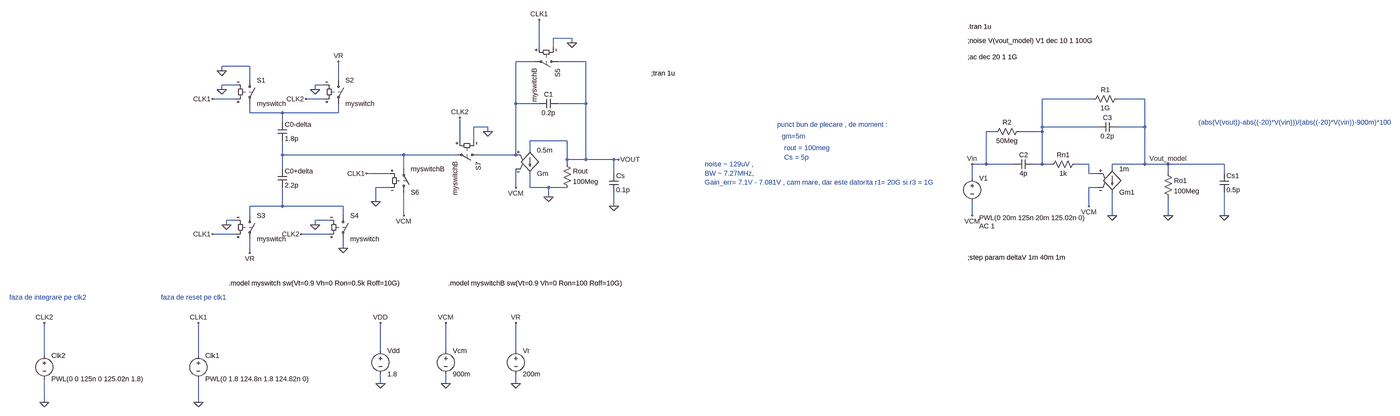
[diagram p0: schematic SCmodel_sw.asc, whole sheet]
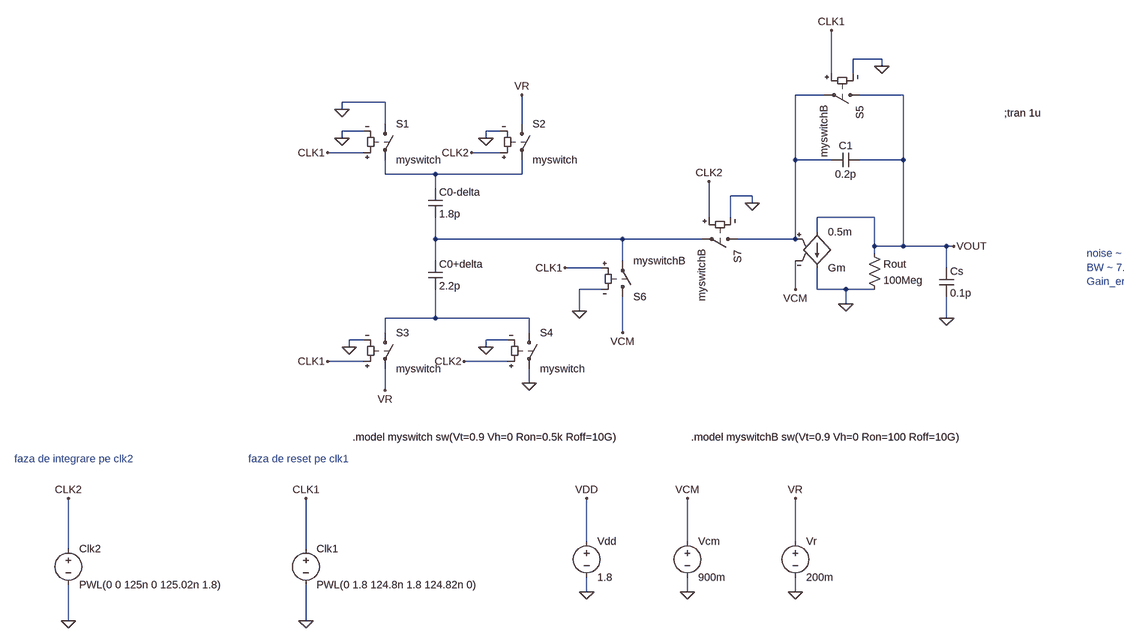
[diagram p1: schematic SCmodel_sw.asc, part, row 1 of 1, column 1 of 2]
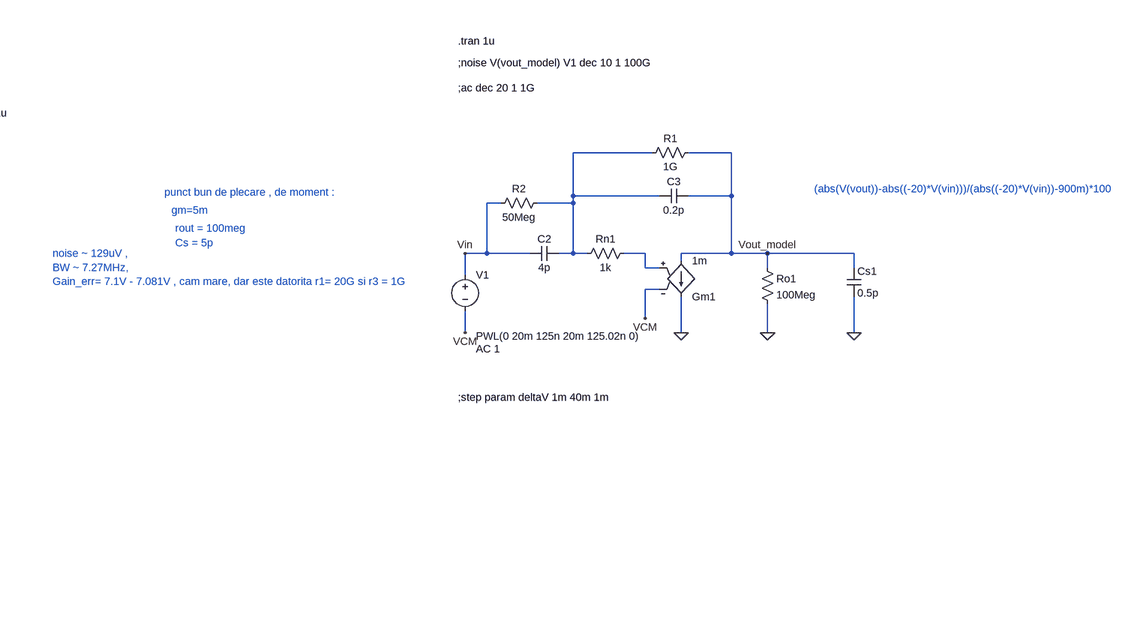
[diagram p2: schematic SCmodel_sw.asc, part, row 1 of 1, column 2 of 2]
SCmodel_sw.asc, the LTspice schematic file:
Version 4
SHEET 1 4916 1124
WIRE 1024 -208 960 -208
WIRE 1024 -192 1024 -208
WIRE 912 -176 912 -272
WIRE 960 -176 960 -208
WIRE 896 -128 832 -128
WIRE 1072 -128 976 -128
WIRE -80 -112 -176 -112
WIRE -176 -96 -176 -112
WIRE -80 -64 -80 -112
WIRE 224 -64 224 -128
WIRE -128 -48 -176 -48
WIRE 176 -48 144 -48
WIRE -176 -32 -176 -48
WIRE 144 -32 144 -48
WIRE -128 0 -208 0
WIRE 176 0 112 0
WIRE 3792 0 3616 0
WIRE 3968 0 3872 0
WIRE 832 16 832 -128
WIRE 912 16 832 16
WIRE 1072 16 1072 -128
WIRE 1072 16 976 16
WIRE -80 48 -80 16
WIRE 32 48 -80 48
WIRE 224 48 224 16
WIRE 224 48 32 48
WIRE 32 80 32 48
WIRE 736 96 688 96
WIRE 3616 96 3616 0
WIRE 3808 96 3616 96
WIRE 3968 96 3968 0
WIRE 3968 96 3872 96
WIRE 736 112 736 96
WIRE 3456 112 3424 112
WIRE 3616 112 3616 96
WIRE 3616 112 3536 112
WIRE 640 144 640 64
WIRE 688 144 688 96
WIRE 1008 144 880 144
WIRE 880 176 880 144
WIRE 32 192 32 144
WIRE 448 192 32 192
WIRE 624 192 448 192
WIRE 832 192 832 16
WIRE 832 192 704 192
WIRE 1008 208 1008 144
WIRE 1072 208 1072 16
WIRE 1072 208 1008 208
WIRE 1168 208 1072 208
WIRE 1184 208 1168 208
WIRE 1008 224 1008 208
WIRE 3424 224 3424 112
WIRE 3424 224 3376 224
WIRE 3520 224 3424 224
WIRE 3616 224 3616 112
WIRE 3616 224 3584 224
WIRE 3648 224 3616 224
WIRE 3776 224 3728 224
WIRE 3968 224 3968 96
WIRE 3968 224 3856 224
WIRE 4048 224 3968 224
WIRE 4240 224 4048 224
WIRE 32 240 32 192
WIRE 448 240 448 192
WIRE 3856 240 3856 224
WIRE 400 256 320 256
WIRE 1168 256 1168 208
WIRE 3776 256 3776 224
WIRE 3808 256 3776 256
WIRE 4048 256 4048 224
WIRE 4240 256 4240 224
WIRE 3376 272 3376 224
WIRE 400 304 352 304
WIRE 832 304 832 240
WIRE 880 304 880 256
WIRE 944 304 880 304
WIRE 1008 304 944 304
WIRE 3808 304 3776 304
WIRE 944 336 944 304
WIRE 352 352 352 304
WIRE 32 368 32 304
WIRE 32 368 -80 368
WIRE 240 368 32 368
WIRE 1168 368 1168 320
WIRE 3776 368 3776 304
WIRE -80 400 -80 368
WIRE 240 400 240 368
WIRE 448 400 448 320
WIRE 3376 400 3376 352
WIRE 3856 400 3856 320
WIRE 4048 400 4048 336
WIRE 4240 400 4240 320
WIRE -128 416 -160 416
WIRE 192 416 144 416
WIRE -160 432 -160 416
WIRE 144 432 144 416
WIRE -128 464 -208 464
WIRE 192 464 96 464
WIRE 240 512 240 480
WIRE -80 528 -80 480
WIRE 368 864 368 768
WIRE 592 864 592 768
WIRE 832 864 832 768
WIRE -784 880 -784 768
WIRE -256 880 -256 768
WIRE 368 976 368 944
WIRE 592 976 592 944
WIRE 832 976 832 944
WIRE -784 1040 -784 960
WIRE -256 1040 -256 960
FLAG 96 464 CLK2
FLAG 112 0 CLK2
FLAG -208 0 CLK1
FLAG -208 464 CLK1
FLAG -160 432 0
FLAG 144 432 0
FLAG 144 -32 0
FLAG -176 -32 0
FLAG -176 -96 0
FLAG 240 512 0
FLAG -80 528 VR
FLAG 224 -128 VR
FLAG -256 768 CLK1
FLAG -784 768 CLK2
FLAG -256 1040 0
FLAG -784 1040 0
FLAG 368 976 0
FLAG 592 976 0
FLAG 832 976 0
FLAG 832 768 VR
FLAG 592 768 VCM
FLAG 368 768 VDD
FLAG 1184 208 VOUT
FLAG 912 -272 CLK1
FLAG 1024 -192 0
FLAG 640 64 CLK2
FLAG 352 352 0
FLAG 320 256 CLK1
FLAG 448 400 VCM
FLAG 736 112 0
FLAG 944 336 0
FLAG 832 304 VCM
FLAG 1168 368 0
FLAG 3856 400 0
FLAG 3776 368 VCM
FLAG 3376 400 VCM
FLAG 4048 400 0
FLAG 4048 224 Vout_model
FLAG 3376 224 Vin
FLAG 4240 400 0
SYMBOL cap 16 80 R0
SYMATTR InstName C0-delta
SYMATTR Value 1.8p
SYMBOL cap 16 240 R0
SYMATTR InstName C0+delta
SYMATTR Value 2.2p
SYMBOL sw -80 -80 R0
SYMATTR InstName S1
SYMATTR Value myswitch
SYMBOL sw 224 -80 R0
SYMATTR InstName S2
SYMATTR Value myswitch
SYMBOL sw -80 384 R0
SYMATTR InstName S3
SYMATTR Value myswitch
SYMBOL sw 240 384 R0
SYMATTR InstName S4
SYMATTR Value myswitch
SYMBOL voltage -256 864 R0
WINDOW 123 0 0 Left 0
WINDOW 39 0 0 Left 0
SYMATTR InstName Clk1
SYMATTR Value PWL(0 1.8 124.8n 1.8 124.82n 0)
SYMBOL voltage -784 864 R0
WINDOW 123 0 0 Left 0
WINDOW 39 0 0 Left 0
SYMATTR InstName Clk2
SYMATTR Value PWL(0 0 125n 0 125.02n 1.8)
SYMBOL voltage 592 848 R0
SYMATTR InstName Vcm
SYMATTR Value 900m
SYMBOL voltage 832 848 R0
SYMATTR InstName Vr
SYMATTR Value 200m
SYMBOL voltage 368 848 R0
SYMATTR InstName Vdd
SYMATTR Value 1.8
SYMBOL cap 976 0 R90
WINDOW 0 0 32 VBottom 2
WINDOW 3 32 32 VTop 2
SYMATTR InstName C1
SYMATTR Value 0.2p
SYMBOL sw 992 -128 R90
SYMATTR InstName S5
SYMATTR Value myswitchB
SYMBOL sw 448 336 M180
SYMATTR InstName S6
SYMATTR Value myswitchB
SYMBOL sw 720 192 R90
SYMATTR InstName S7
SYMATTR Value myswitchB
SYMBOL g2 880 272 M180
SYMATTR InstName Gm
SYMATTR Value 0.5m
SYMBOL res 992 208 R0
SYMATTR InstName Rout
SYMATTR Value 100Meg
SYMBOL cap 1152 256 R0
SYMATTR InstName Cs
SYMATTR Value 0.1p
SYMBOL voltage 3376 256 R0
WINDOW 3 24 152 Left 2
WINDOW 123 24 180 Left 2
WINDOW 39 0 0 Left 0
SYMATTR Value PWL(0 20m 125n 20m 125.02n 0)
SYMATTR Value2 AC 1
SYMATTR InstName V1
SYMBOL cap 3584 208 R90
WINDOW 0 0 32 VBottom 2
WINDOW 3 32 32 VTop 2
SYMATTR InstName C2
SYMATTR Value 4p
SYMBOL cap 3872 80 R90
WINDOW 0 0 32 VBottom 2
WINDOW 3 32 32 VTop 2
SYMATTR InstName C3
SYMATTR Value 0.2p
SYMBOL res 3744 208 R90
WINDOW 0 0 56 VBottom 2
WINDOW 3 32 56 VTop 2
SYMATTR InstName Rn1
SYMATTR Value 1k
SYMBOL g2 3856 336 M180
SYMATTR InstName Gm1
SYMATTR Value 1m
SYMBOL res 4032 240 R0
SYMATTR InstName Ro1
SYMATTR Value 100Meg
SYMATTR Value2 noiseless
SYMBOL res 3888 -16 R90
WINDOW 0 0 56 VBottom 2
WINDOW 3 32 56 VTop 2
SYMATTR InstName R1
SYMATTR Value 1G
SYMATTR Value2 noiseless
SYMBOL cap 4224 256 R0
SYMATTR InstName Cs1
SYMATTR Value 0.5p
SYMBOL res 3552 96 R90
WINDOW 0 0 56 VBottom 2
WINDOW 3 32 56 VTop 2
SYMATTR InstName R2
SYMATTR Value 50Meg
SYMATTR Value2 noiseless
TEXT -152 632 Left 2 !.model myswitch sw(Vt=0.9 Vh=0 Ron=0.5k Roff=10G)
TEXT 1296 -88 Left 2 !;tran 1u
TEXT -904 680 Left 2 ;faza de integrare pe clk2
TEXT -384 680 Left 2 ;faza de reset pe clk1
TEXT 600 632 Left 2 !.model myswitchB sw(Vt=0.9 Vh=0 Ron=100 Roff=10G)
TEXT 3360 -144 Left 2 !;ac dec 20 1 1G
TEXT 3360 -248 Left 2 !.tran 1u
TEXT 3360 -200 Left 2 !;noise V(vout_model) V1 dec 10 1 100G
TEXT 2456 88 Left 2 ;punct bun de plecare , de moment :
TEXT 2472 128 Left 2 ;gm=5m
TEXT 2480 168 Left 2 ;rout = 100meg
TEXT 2480 200 Left 2 ;Cs = 5p
TEXT 2208 224 Left 2 ;noise ~ 129uV , \nBW ~ 7.27MHz,\nGain_err= 7.1V - 7.081V , cam mare, dar este datorita r1= 20G si r3 = 1G
TEXT 3360 544 Left 2 !;step param deltaV 1m 40m 1m
TEXT 4152 80 Left 2 ;(abs(V(vout))-abs((-20)*V(vin)))/(abs((-20)*V(vin))-900m)*100

The netlist it stands for:
* SCmodel_sw.asc
C0-delta N003 N004 1.8p
C0+delta N004 N006 2.2p
S1 0 N003 CLK1 0 myswitch
S2 VR N003 CLK2 0 myswitch
S3 N006 VR CLK1 0 myswitch
S4 N006 0 CLK2 0 myswitch
V§Clk1 CLK1 0 PWL(0 1.8 124.8n 1.8 124.82n 0)
V§Clk2 CLK2 0 PWL(0 0 125n 0 125.02n 1.8)
Vcm VCM 0 900m
Vr VR 0 200m
Vdd VDD 0 1.8
C1 VOUT N001 0.2p
S5 VOUT N001 CLK1 0 myswitchB
S6 VCM N004 CLK1 0 myswitchB
S7 N001 N004 CLK2 0 myswitchB
Gm VOUT 0 N001 VCM 0.5m
Rout VOUT 0 100Meg
Cs VOUT 0 0.1p
V1 Vin VCM PWL(0 20m 125n 20m 125.02n 0) AC 1
C2 N002 Vin 4p
C3 Vout_model N002 0.2p
Rn1 N005 N002 1k
Gm1 Vout_model 0 N005 VCM 1m
Ro1 Vout_model 0 100Meg noiseless
R1 Vout_model N002 1G noiseless
Cs1 Vout_model 0 0.5p
R2 N002 Vin 50Meg noiseless
.model myswitch sw(Vt=0.9 Vh=0 Ron=0.5k Roff=10G)
;tran 1u
* faza de integrare pe clk2
* faza de reset pe clk1
.model myswitchB sw(Vt=0.9 Vh=0 Ron=100 Roff=10G)
;ac dec 20 1 1G
.tran 1u
;noise V(vout_model) V1 dec 10 1 100G
* punct bun de plecare , de moment :
* gm=5m
* rout = 100meg
* Cs = 5p
* noise ~ 129uV ,
* BW ~ 7.27MHz,
* Gain_err= 7.1V - 7.081V , cam mare, dar este datorita r1= 20G si r3 = 1G
;step param deltaV 1m 40m 1m
* (abs(V(vout))-abs((-20)*V(vin)))/(abs((-20)*V(vin))-900m)*100
.backanno
.end

* Results of the author's LTspice run, read from the files saved beside the schematic
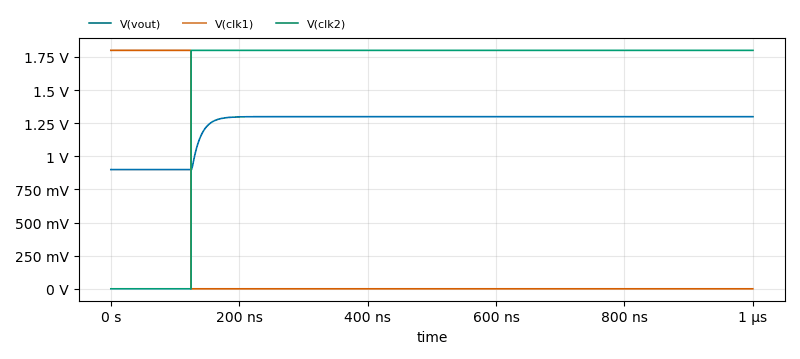
[diagram p3: Transient Analysis of SCmodel_sw.asc, plotted from the saved traces]
* Transient Analysis, 1 run:
*   V(vout): min 898.6 mV, max 1.299 V, average 1.243 V, rms 1.251 V, last 1.299 V
*   V(clk1): min 0 V, max 1.8 V, average 224.7 mV, rms 635.9 mV, last 0 V
*   V(clk2): min 0 V, max 1.8 V, average 1.575 V, rms 1.684 V, last 1.8 V